# EAGLE board cfc-card (EAGLE 9.6.2), part 1 of 2
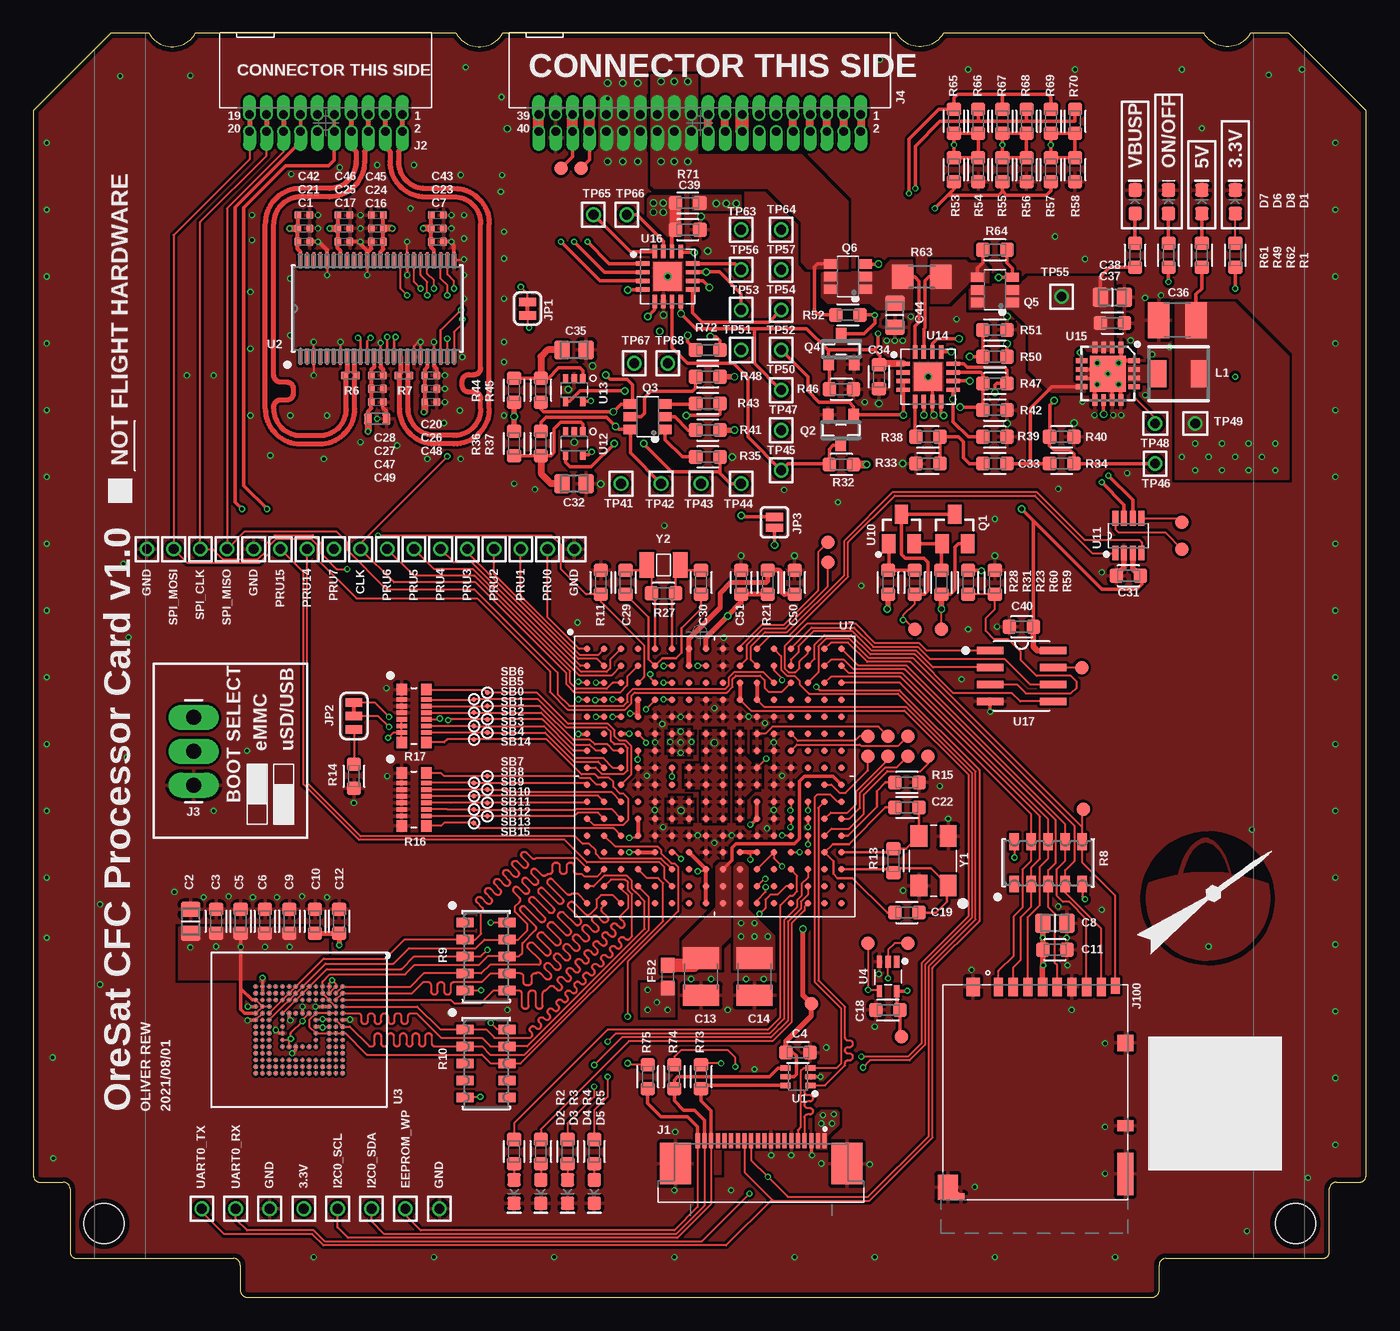
[diagram p9: board, top side]
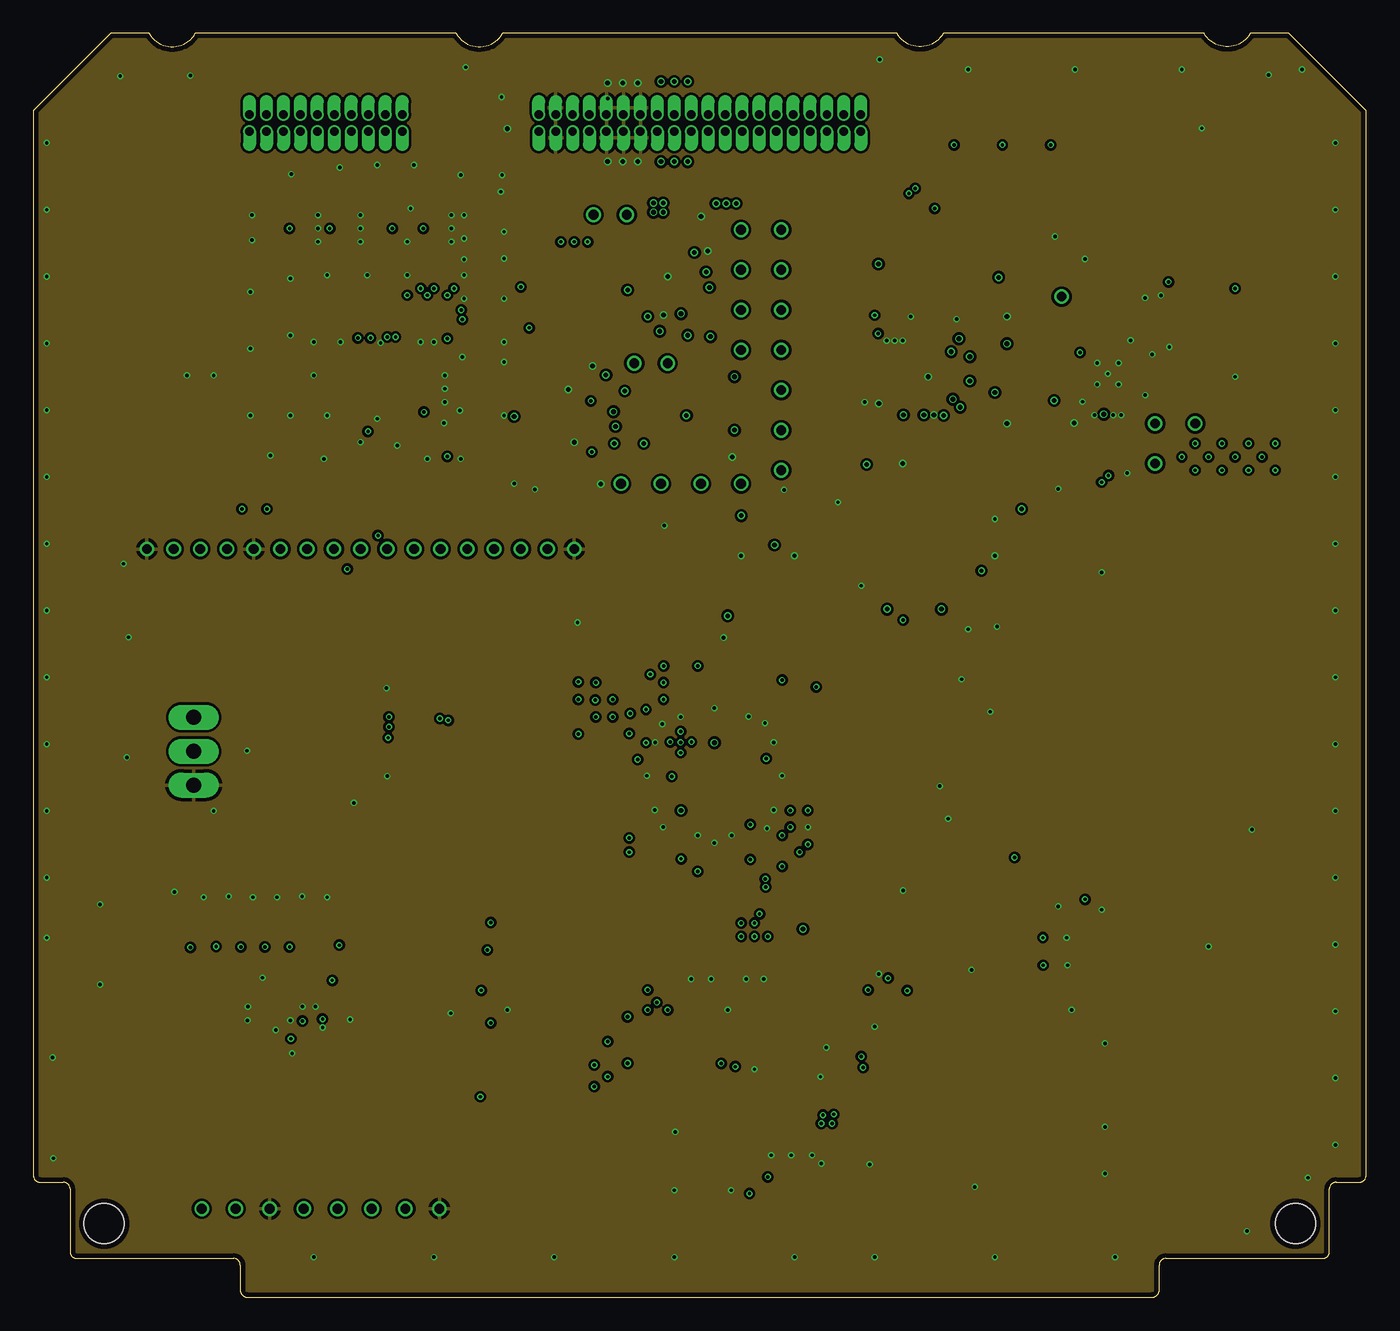
[diagram p10: board, inner layer Route2]
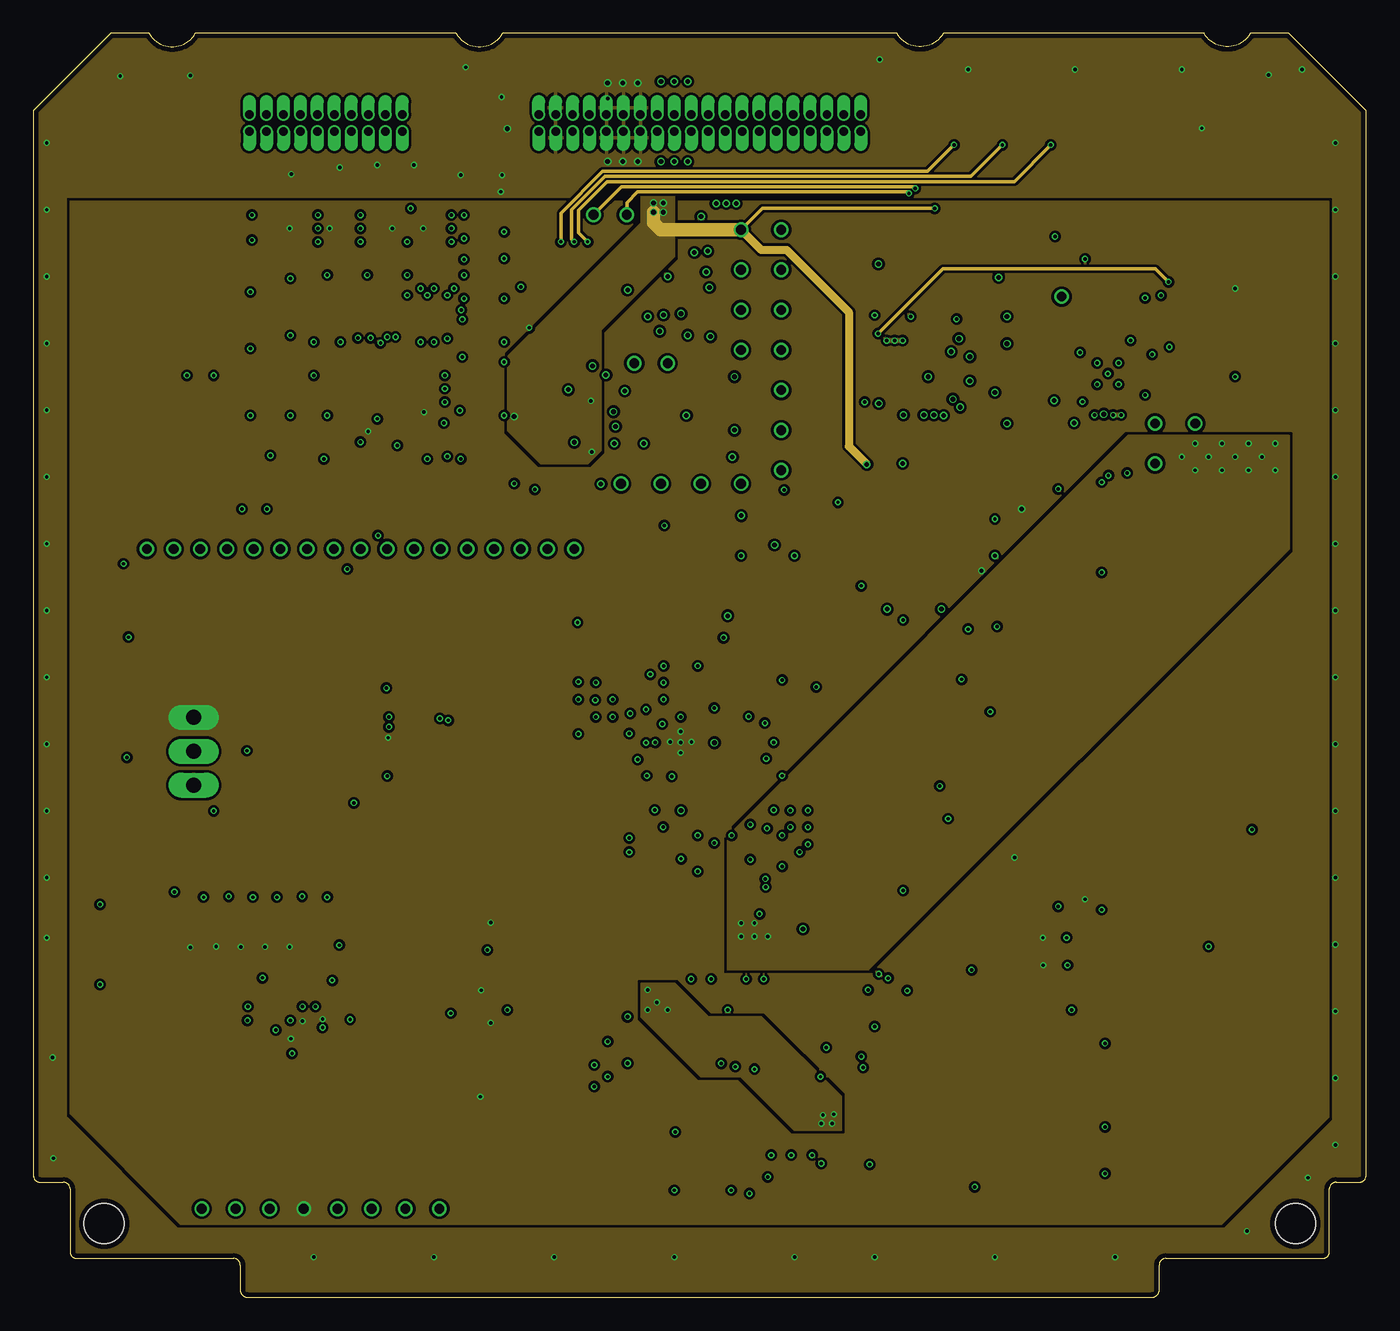
[diagram p11: board, inner layer Route15]
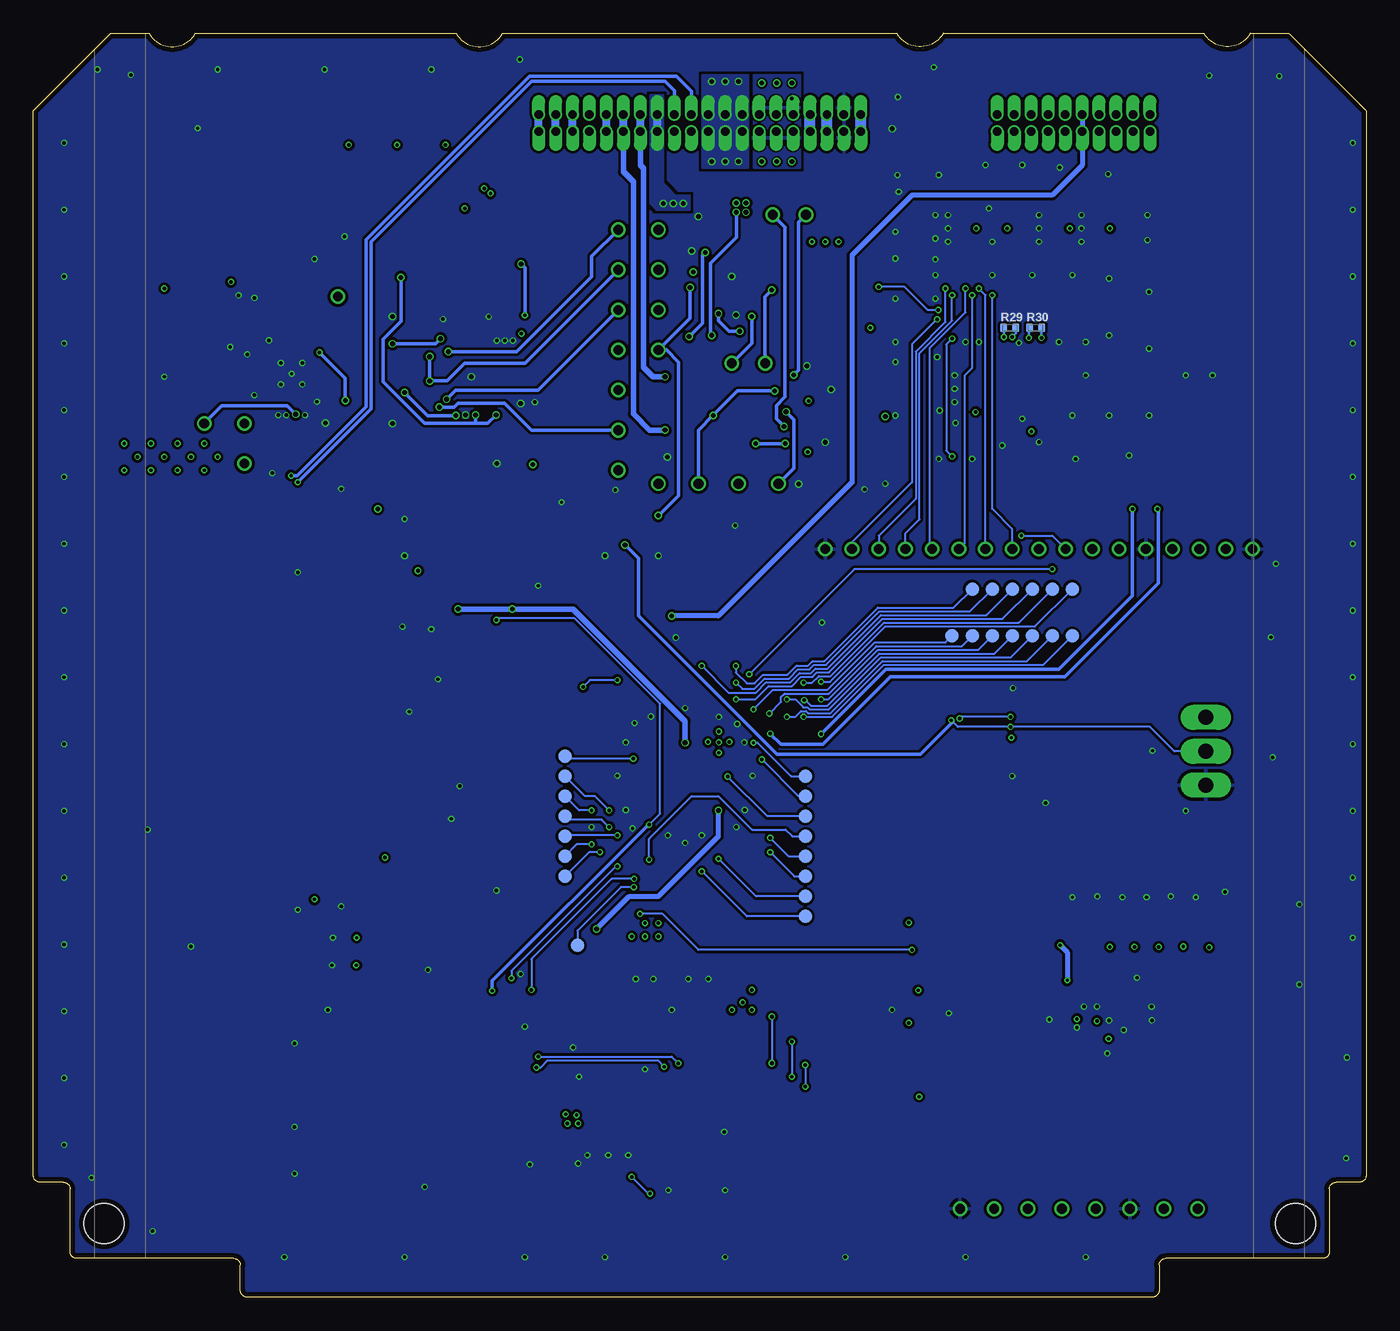
[diagram p12: board, bottom side, seen from below]

Size 99.8 x 94.6 mm. Coordinates in mm from the lower left corner, seen from the top.
Copper layers (1*2*15*16): Top 0.035559375mm / dielectric 0.17018125mm / Route2 0.01778125mm / dielectric 47mil / Route15 0.01778125mm / dielectric 0.17018125mm / Bottom 0.035559375mm
Design rules "4-layer_tented *": minimum track width 5mil, minimum drill 10mil, track to track 5mil, track to pad 5mil, pad to pad 5mil, via to via 5mil, smd to smd 5mil, copper to edge 15mil, drill to drill 6mil, minimum pad ring 4mil, minimum via ring 4mil, stop-mask expansion 2.5mil, vias tented up to drill 20mil, thermal gap 10mil
Net classes: 1 diff pair: width 0.381 mm, clearance 0.508 mm to class 0, clearance 0.254 mm

## Footprints (pad centres in the part's own frame; a part is rotated, then mirrored left to right if it is on the bottom)
.0402-C-NOSILK = smd 0.5 x 0.6: 1 -0.45,0; 2 0.45,0
.0805-B = smd 1.15 x 1.45: 1 -0.9,0; 2 0.9,0
.0603-A = smd 1 x 1.05: 1 -0.9,0; 2 0.9,0
C1210 = smd 1.6 x 2.7: 1 -1.4,0; 2 1.4,0
.0805-B-NOSILK = smd 1.15 x 1.45: 1 -0.9,0; 2 0.9,0
.0603-C-NOSILK = smd 0.6 x 0.9: 1 -0.7,0; 2 0.7,0
LED-0603 = smd 1 x 1: A -0.877,0; C 0.877,0
0603 = smd 1.1 x 1: 1 -0.85,0; 2 0.85,0
TE_2-1734592-0 = smd 0.3 x 1.1: 1 -4.75,-1.7; 2 -4.25,-1.7; 3 -3.75,-1.7; 4 -3.25,-1.7; 5 -2.75,-1.7; 6 -2.25,-1.7; 7 -1.75,-1.7; 8 -1.25,-1.7; 9 -0.75,-1.7; 10 -0.25,-1.7; 11 0.25,-1.7; 12 0.75,-1.7; 13 1.25,-1.7; 14 1.75,-1.7; 15 2.25,-1.7; 16 2.75,-1.7; 17 3.25,-1.7; 18 3.75,-1.7; 19 4.25,-1.7; 20 4.75,-1.7 | smd 2.3 x 3.1: PAD1 6.42,0; PAD2 -6.42,0
J-SAMTEC-TFM-110-X1-XXX-D-RA = drill 0.635 pad 0.965 offset: 1 5.715,0.635; 2 5.715,-0.635; 3 4.445,0.635; 4 4.445,-0.635; 5 3.175,0.635; 6 3.175,-0.635; 7 1.905,0.635; 8 1.905,-0.635; 9 0.635,0.635; 10 0.635,-0.635; 11 -0.635,0.635; 12 -0.635,-0.635; 13 -1.905,0.635; 14 -1.905,-0.635; 15 -3.175,0.635; 16 -3.175,-0.635; 17 -4.445,0.635; 18 -4.445,-0.635; 19 -5.715,0.635; 20 -5.715,-0.635
1X03_LONGPADS = drill 1.118 pad 1.88 long: 1 0,0; 2 2.54,0; 3 5.08,0
J-SAMTEC-TFM-120-X1-XXX-D-RA = drill 0.635 pad 0.965 offset: 1 12.065,0.635; 2 12.065,-0.635; 3 10.795,0.635; 4 10.795,-0.635; 5 9.525,0.635; 6 9.525,-0.635; 7 8.255,0.635; 8 8.255,-0.635; 9 6.985,0.635; 10 6.985,-0.635; 11 5.715,0.635; 12 5.715,-0.635; 13 4.445,0.635; 14 4.445,-0.635; 15 3.175,0.635; 16 3.175,-0.635; 17 1.905,0.635; 18 1.905,-0.635; 19 0.635,0.635; 20 0.635,-0.635; 21 -0.635,0.635; 22 -0.635,-0.635; 23 -1.905,0.635; 24 -1.905,-0.635; 25 -3.175,0.635; 26 -3.175,-0.635; 27 -4.445,0.635; 28 -4.445,-0.635; 29 -5.715,0.635; 30 -5.715,-0.635; 31 -6.985,0.635; 32 -6.985,-0.635; 33 -8.255,0.635; 34 -8.255,-0.635; 35 -9.525,0.635; 36 -9.525,-0.635; 37 -10.795,0.635; 38 -10.795,-0.635; 39 -12.065,0.635; 40 -12.065,-0.635
DM3BT-DSF-PEJS = smd 0.7 x 1.4: 1 -3.2,15.95; 2 -2.1,15.95; 3 -1,15.95; 4 0.1,15.95; 5 1.2,15.95; 6 2.3,15.95; 7 3.4,15.95; 8 4.5,15.95 | smd 0.7 x 1.2: CD 5.55,16.05 | smd 0.5 x 0.5: CGND1 -6,0.25 | smd 1.5 x 1.9: CGND2 -7,0.95 | smd 0.21 x 0.21 rotated 45: CGND3 -6.25,0.5 | smd 1 x 1.4: CGND4 -5.1,15.95 | smd 1.2 x 1.2: CGND5 6.3,11.75 | smd 1.2 x 3.2: CGND6 6.3,1.95 | smd 1.2 x 0.8: GND 6.3,5.55
SMT-JUMPER_2_NC_TRACE_SILK = smd 0.635 x 1.27: 1 -0.508,0; 2 0.508,0
SMT-JUMPER_3_1-NC_TRACE_SILK = smd 0.635 x 1.27: 1 -1.016,0; 2 0,0; 3 1.016,0
SMT-JUMPER_2_NO_SILK = smd 0.635 x 1.27: 1 -0.406,0; 2 0.406,0
ECS-MPI4040 = smd 2 x 1.3: 1 0,1.575; 2 0,-1.575
ORESAT-CARD-V1.3-GENERIC-0RF = hole 3: 94.5,5.5; 5.3,5.5
SOT23-BEC = smd 1 x 1.4: B -0.95,-1.1; C 0,1.1; E 0.95,-1.1
SOT23 = smd 0.787 x 0.889: 1 -0.953,-1.143; 2 0.953,-1.143; 3 0,1.143
SOT23-6 = smd 0.7 x 1: 1 -0.95,-1.3; 2 0,-1.3; 3 0.95,-1.3; 4 0.95,1.3; 5 0,1.3; 6 -0.95,1.3
ARRAY_EXBA-M = smd 1.27 x 0.711: 1 -1.575,2.54; 2 -1.575,1.27; 3 -1.575,0; 4 -1.575,-1.27; 5 -1.575,-2.54; 6 1.575,-2.54; 7 1.575,-1.27; 8 1.575,0; 9 1.575,1.27; 10 1.575,2.54
RES_EXB2HV = smd 0.787 x 0.864: 1 -0.914,1.981; 8 -0.914,-1.981; 9 0.914,-1.981; 16 0.914,1.981 | smd 0.787 x 0.356: 2 -0.914,1.234; 3 -0.914,0.74; 4 -0.914,0.247; 5 -0.914,-0.247; 6 -0.914,-0.74; 7 -0.914,-1.234; 10 0.914,-1.234; 11 0.914,-0.74; 12 0.914,-0.247; 13 0.914,0.247; 14 0.914,0.74; 15 0.914,1.234
R1206 = smd 1.6 x 1.803: 1 -1.422,0; 2 1.422,0
TEST-POINT-SMALL = smd 0.381 x 0.381: TP 0,0
2MM-TEST-POINT = drill 0.737: 1 0,0
PAD.03X.04 = smd 1.016 x 1.016: P$1 0,0
SC70-6 = smd 0.4 x 0.75: 1 -0.65,-0.925; 2 0,-0.925; 3 0.65,-0.925; 4 0.65,0.925; 5 0,0.925; 6 -0.65,0.925
MTD48_TEX-L = smd 1.168 x 0.178: 1 -3.619,5.75; 2 -3.619,5.25; 3 -3.619,4.75; 4 -3.619,4.25; 5 -3.619,3.75; 6 -3.619,3.25; 7 -3.619,2.75; 8 -3.619,2.25; 9 -3.619,1.75; 10 -3.619,1.25; 11 -3.619,0.75; 12 -3.619,0.25; 13 -3.619,-0.25; 14 -3.619,-0.75; 15 -3.619,-1.25; 16 -3.619,-1.75; 17 -3.619,-2.25; 18 -3.619,-2.75; 19 -3.619,-3.25; 20 -3.619,-3.75; 21 -3.619,-4.25; 22 -3.619,-4.75; 23 -3.619,-5.25; 24 -3.619,-5.75; 25 3.619,-5.75; 26 3.619,-5.25; 27 3.619,-4.75; 28 3.619,-4.25; 29 3.619,-3.75; 30 3.619,-3.25; 31 3.619,-2.75; 32 3.619,-2.25; 33 3.619,-1.75; 34 3.619,-1.25; 35 3.619,-0.75; 36 3.619,-0.25; 37 3.619,0.25; 38 3.619,0.75; 39 3.619,1.25; 40 3.619,1.75; 41 3.619,2.25; 42 3.619,2.75; 43 3.619,3.25; 44 3.619,3.75; 45 3.619,4.25; 46 3.619,4.75; 47 3.619,5.25; 48 3.619,5.75
BGA-153(11.5X13)(EMMC-BA) = smd 0.28 x 0.28: A1 -3.25,3.25; A2 -2.75,3.25; A3 -2.25,3.25; A4 -1.75,3.25; A5 -1.25,3.25; A6 -0.75,3.25; A7 -0.25,3.25; A8 0.25,3.25; A9 0.75,3.25; A10 1.25,3.25; A11 1.75,3.25; A12 2.25,3.25; A13 2.75,3.25; A14 3.25,3.25; B1 -3.25,2.75; B2 -2.75,2.75; B3 -2.25,2.75; B4 -1.75,2.75; B5 -1.25,2.75; B6 -0.75,2.75; B7 -0.25,2.75; B8 0.25,2.75; B9 0.75,2.75; B10 1.25,2.75; B11 1.75,2.75; B12 2.25,2.75; B13 2.75,2.75; B14 3.25,2.75; C1 -3.25,2.25; C2 -2.75,2.25; C3 -2.25,2.25; C4 -1.75,2.25; C5 -1.25,2.25; C6 -0.75,2.25; C7 -0.25,2.25; C8 0.25,2.25; C9 0.75,2.25; C10 1.25,2.25; C11 1.75,2.25; C12 2.25,2.25; C13 2.75,2.25; C14 3.25,2.25; D1 -3.25,1.75; D2 -2.75,1.75; D3 -2.25,1.75; D4 -1.75,1.75; D12 2.25,1.75; D13 2.75,1.75; D14 3.25,1.75; E1 -3.25,1.25; E2 -2.75,1.25; E3 -2.25,1.25; E5 -1.25,1.25; E6 -0.75,1.25; E7 -0.25,1.25; E8 0.25,1.25; E9 0.75,1.25; E10 1.25,1.25; E12 2.25,1.25; E13 2.75,1.25; E14 3.25,1.25; F1 -3.25,0.75; F2 -2.75,0.75; F3 -2.25,0.75; F5 -1.25,0.75; F10 1.25,0.75; F12 2.25,0.75; F13 2.75,0.75; F14 3.25,0.75; G1 -3.25,0.25; G2 -2.75,0.25; G3 -2.25,0.25; G5 -1.25,0.25; G10 1.25,0.25; G12 2.25,0.25; G13 2.75,0.25; G14 3.25,0.25; H1 -3.25,-0.25; H2 -2.75,-0.25; H3 -2.25,-0.25; H5 -1.25,-0.25; H10 1.25,-0.25; H12 2.25,-0.25; H13 2.75,-0.25; H14 3.25,-0.25; J1 -3.25,-0.75; J2 -2.75,-0.75; J3 -2.25,-0.75; J5 -1.25,-0.75; J10 1.25,-0.75; J12 2.25,-0.75; J13 2.75,-0.75; J14 3.25,-0.75; K1 -3.25,-1.25; K2 -2.75,-1.25; K3 -2.25,-1.25; K5 -1.25,-1.25; K6 -0.75,-1.25; K7 -0.25,-1.25; K8 0.25,-1.25; K9 0.75,-1.25; K10 1.25,-1.25; K12 2.25,-1.25; K13 2.75,-1.25; K14 3.25,-1.25; L1 -3.25,-1.75; L2 -2.75,-1.75; L3 -2.25,-1.75; L12 2.25,-1.75; L13 2.75,-1.75; L14 3.25,-1.75; M1 -3.25,-2.25; M2 -2.75,-2.25; M3 -2.25,-2.25; M4 -1.75,-2.25; M5 -1.25,-2.25; M6 -0.75,-2.25; M7 -0.25,-2.25; M8 0.25,-2.25; M9 0.75,-2.25; M10 1.25,-2.25; M11 1.75,-2.25; M12 2.25,-2.25; M13 2.75,-2.25; M14 3.25,-2.25; N1 -3.25,-2.75; N2 -2.75,-2.75; N3 -2.25,-2.75; N4 -1.75,-2.75; N5 -1.25,-2.75; N6 -0.75,-2.75; N7 -0.25,-2.75; N8 0.25,-2.75; N9 0.75,-2.75; N10 1.25,-2.75; N11 1.75,-2.75; N12 2.25,-2.75; N13 2.75,-2.75; N14 3.25,-2.75; P1 -3.25,-3.25; P2 -2.75,-3.25; P3 -2.25,-3.25; P4 -1.75,-3.25; P5 -1.25,-3.25; P6 -0.75,-3.25; P7 -0.25,-3.25; P8 0.25,-3.25; P9 0.75,-3.25; P10 1.25,-3.25; P11 1.75,-3.25; P12 2.25,-3.25; P13 2.75,-3.25; P14 3.25,-3.25
C70(TI-DCK) = smd 0.4 x 0.9: 1 0.65,1.1; 2 0,1.1; 3 -0.65,1.1; 4 -0.65,-1.1; 5 0.65,-1.1
OSD335X-BGA-256 = smd 0.5 x 0.5: A1 -9.525,-9.525; A2 -9.525,-8.255; A3 -9.525,-6.985; A4 -9.525,-5.715; A5 -9.525,-4.445; A6 -9.525,-3.175; A7 -9.525,-1.905; A8 -9.525,-0.635; A9 -9.525,0.635; A10 -9.525,1.905; A11 -9.525,3.175; A12 -9.525,4.445; A13 -9.525,5.715; A14 -9.525,6.985; A15 -9.525,8.255; A16 -9.525,9.525; B1 -8.255,-9.525; B2 -8.255,-8.255; B3 -8.255,-6.985; B4 -8.255,-5.715; B5 -8.255,-4.445; B6 -8.255,-3.175; B7 -8.255,-1.905; B8 -8.255,-0.635; B9 -8.255,0.635; B10 -8.255,1.905; B11 -8.255,3.175; B12 -8.255,4.445; B13 -8.255,5.715; B14 -8.255,6.985; B15 -8.255,8.255; B16 -8.255,9.525; C1 -6.985,-9.525; C2 -6.985,-8.255; C3 -6.985,-6.985; C4 -6.985,-5.715; C5 -6.985,-4.445; C6 -6.985,-3.175; C7 -6.985,-1.905; C8 -6.985,-0.635; C9 -6.985,0.635; C10 -6.985,1.905; C11 -6.985,3.175; C12 -6.985,4.445; C13 -6.985,5.715; C14 -6.985,6.985; C15 -6.985,8.255; C16 -6.985,9.525; D1 -5.715,-9.525; D2 -5.715,-8.255; D3 -5.715,-6.985; D4 -5.715,-5.715; D5 -5.715,-4.445; D6 -5.715,-3.175; D7 -5.715,-1.905; D8 -5.715,-0.635; D9 -5.715,0.635; D10 -5.715,1.905; D11 -5.715,3.175; D12 -5.715,4.445; D13 -5.715,5.715; D14 -5.715,6.985; D15 -5.715,8.255; D16 -5.715,9.525; E1 -4.445,-9.525; E2 -4.445,-8.255; E3 -4.445,-6.985; E4 -4.445,-5.715; E5 -4.445,-4.445; E6 -4.445,-3.175; E7 -4.445,-1.905; E8 -4.445,-0.635; E9 -4.445,0.635; E10 -4.445,1.905; E11 -4.445,3.175; E12 -4.445,4.445; E13 -4.445,5.715; E14 -4.445,6.985; E15 -4.445,8.255; E16 -4.445,9.525; F1 -3.175,-9.525; F2 -3.175,-8.255; F3 -3.175,-6.985; F4 -3.175,-5.715; F5 -3.175,-4.445; F6 -3.175,-3.175; F7 -3.175,-1.905; F8 -3.175,-0.635; F9 -3.175,0.635; F10 -3.175,1.905; F11 -3.175,3.175; F12 -3.175,4.445; F13 -3.175,5.715; F14 -3.175,6.985; F15 -3.175,8.255; F16 -3.175,9.525; G1 -1.905,-9.525; G2 -1.905,-8.255; G3 -1.905,-6.985; G4 -1.905,-5.715; G5 -1.905,-4.445; G6 -1.905,-3.175; G7 -1.905,-1.905; G8 -1.905,-0.635; G9 -1.905,0.635; G10 -1.905,1.905; G11 -1.905,3.175; G12 -1.905,4.445; G13 -1.905,5.715; G14 -1.905,6.985; G15 -1.905,8.255; G16 -1.905,9.525; H1 -0.635,-9.525; H2 -0.635,-8.255; H3 -0.635,-6.985; H4 -0.635,-5.715; H5 -0.635,-4.445; H6 -0.635,-3.175; H7 -0.635,-1.905; H8 -0.635,-0.635; H9 -0.635,0.635; H10 -0.635,1.905; H11 -0.635,3.175; H12 -0.635,4.445; H13 -0.635,5.715; H14 -0.635,6.985; H15 -0.635,8.255; H16 -0.635,9.525; J1 0.635,-9.525; J2 0.635,-8.255; J3 0.635,-6.985; J4 0.635,-5.715; J5 0.635,-4.445; J6 0.635,-3.175; J7 0.635,-1.905; J8 0.635,-0.635; J9 0.635,0.635; J10 0.635,1.905; J11 0.635,3.175; J12 0.635,4.445; J13 0.635,5.715; J14 0.635,6.985; J15 0.635,8.255; J16 0.635,9.525; K1 1.905,-9.525; K2 1.905,-8.255; K3 1.905,-6.985; K4 1.905,-5.715; K5 1.905,-4.445; K6 1.905,-3.175; K7 1.905,-1.905; K8 1.905,-0.635; K9 1.905,0.635; K10 1.905,1.905; K11 1.905,3.175; K12 1.905,4.445; K13 1.905,5.715; K14 1.905,6.985; K15 1.905,8.255; K16 1.905,9.525; L1 3.175,-9.525; L2 3.175,-8.255; L3 3.175,-6.985; L4 3.175,-5.715; L5 3.175,-4.445; L6 3.175,-3.175; L7 3.175,-1.905; L8 3.175,-0.635; L9 3.175,0.635; L10 3.175,1.905; L11 3.175,3.175; L12 3.175,4.445; L13 3.175,5.715; L14 3.175,6.985; L15 3.175,8.255; L16 3.175,9.525; M1 4.445,-9.525; M2 4.445,-8.255; M3 4.445,-6.985; M4 4.445,-5.715; M5 4.445,-4.445; M6 4.445,-3.175; M7 4.445,-1.905; M8 4.445,-0.635; M9 4.445,0.635; M10 4.445,1.905; M11 4.445,3.175; M12 4.445,4.445; M13 4.445,5.715; M14 4.445,6.985; M15 4.445,8.255; M16 4.445,9.525; N1 5.715,-9.525; N2 5.715,-8.255; N3 5.715,-6.985; N4 5.715,-5.715; N5 5.715,-4.445; N6 5.715,-3.175; N7 5.715,-1.905; N8 5.715,-0.635; N9 5.715,0.635; N10 5.715,1.905; N11 5.715,3.175; N12 5.715,4.445; N13 5.715,5.715; N14 5.715,6.985; N15 5.715,8.255; N16 5.715,9.525; P1 6.985,-9.525; P2 6.985,-8.255; P3 6.985,-6.985; P4 6.985,-5.715; P5 6.985,-4.445; P6 6.985,-3.175; P7 6.985,-1.905; P8 6.985,-0.635; P9 6.985,0.635; P10 6.985,1.905; P11 6.985,3.175; P12 6.985,4.445; P13 6.985,5.715; P14 6.985,6.985; P15 6.985,8.255; P16 6.985,9.525; R1 8.255,-9.525; R2 8.255,-8.255; R3 8.255,-6.985; R4 8.255,-5.715; R5 8.255,-4.445; R6 8.255,-3.175; R7 8.255,-1.905; R8 8.255,-0.635; R9 8.255,0.635; R10 8.255,1.905; R11 8.255,3.175; R12 8.255,4.445; R13 8.255,5.715; R14 8.255,6.985; R15 8.255,8.255; R16 8.255,9.525; T1 9.525,-9.525; T2 9.525,-8.255; T3 9.525,-6.985; T4 9.525,-5.715; T5 9.525,-4.445; T6 9.525,-3.175; T7 9.525,-1.905; T8 9.525,-0.635; T9 9.525,0.635; T10 9.525,1.905; T11 9.525,3.175; T12 9.525,4.445; T13 9.525,5.715; T14 9.525,6.985; T15 9.525,8.255; T16 9.525,9.525
SOT23-3 = smd 1 x 1.4: 1 -0.95,-1.1; 2 0.95,-1.1; 3 0,1.1
SOT23-8_TI-DCN = smd 0.45 x 1.1: 1 -0.975,-1.3; 2 -0.325,-1.3; 3 0.325,-1.3; 4 0.975,-1.3; 5 0.975,1.3; 6 0.325,1.3; 7 -0.325,1.3; 8 -0.975,1.3
SC70-5 = smd 0.4 x 0.7: 1 -0.65,-0.85; 2 0,-0.85; 3 0.65,-0.85; 4 0.65,0.85; 5 -0.65,0.85
QFN65P400X400X80-17T210 = smd 1.01 x 0.32: 1 -1.86,0.975; 2 -1.86,0.325; 3 -1.86,-0.325; 4 -1.86,-0.975; 9 1.86,-0.975; 10 1.86,-0.325; 11 1.86,0.325; 12 1.86,0.975 | smd 0.32 x 1.01: 5 -0.975,-1.86; 6 -0.325,-1.86; 7 0.325,-1.86; 8 0.975,-1.86; 13 0.975,1.86; 14 0.325,1.86; 15 -0.325,1.86; 16 -0.975,1.86 | smd 2.1 x 2.1: EPAD 0,0
S-PVQFN-16 = smd 0.85 x 0.35: 1 -1.975,0.975; 2 -1.975,0.325; 3 -1.975,-0.325; 4 -1.975,-0.975; 9 1.975,-0.975; 10 1.975,-0.325; 11 1.975,0.325; 12 1.975,0.975 | smd 0.35 x 0.85: 5 -0.975,-1.975; 6 -0.325,-1.975; 7 0.325,-1.975; 8 0.975,-1.975; 13 0.975,1.975; 14 0.325,1.975; 15 -0.325,1.975; 16 -0.975,1.975 | smd 2.7 x 2.7: PAD 0,0
SOIC8 = smd 1.981 x 0.559: 1 -2.362,1.905; 2 -2.362,0.635; 3 -2.362,-0.635; 4 -2.362,-1.905; 5 2.362,-1.905; 6 2.362,-0.635; 7 2.362,0.635; 8 2.362,1.905
5X3.2-4SMD = smd 1.6 x 1.25: 1 -1.85,-1.1; 2 1.85,-1.1; 3 1.85,1.1; 4 -1.85,1.1
CRYSTAL_3.2X1.5 = smd 1.1 x 1.9: P$1 -1.25,0; P$2 1.25,0

## Placement (x,y rotation side)
C1  1n  [.0402-C-NOSILK]  20.25,79 0 top
C2  10uF  [.0805-B]  11.78,28.12 90 top
C3  1uF  [.0603-A]  13.68,28.12 90 top
C4  0.1uF  [.0603-A]  57.25,18.31 0 top
C5  1uF  [.0603-A]  15.53,28.12 90 top
C6  1uF  [.0603-A]  17.34,28.12 90 top
C7  1n  [.0402-C-NOSILK]  30.25,79 0 top
C8  10uF  [.0805-B]  76.5,28 0 top
C9  1uF  [.0603-A]  19.18,28.12 90 top
C10  1uF  [.0603-A]  21.09,28.12 90 top
C11  0.1uF  [.0603-A]  76.5,26 0 top
C12  1uF  [.0603-A]  22.9,28.12 90 top
C13  22uF  [C1210]  50,24 270 top
C14  22uF  [C1210]  54,24 270 top
C16  1n  [.0402-C-NOSILK]  25.75,79 180 top
C17  1n  [.0402-C-NOSILK]  23.25,79 0 top
C18  0.1uF  [.0603-A]  64,21.5 180 top
C19  18pF, 50V  [.0603-A]  65.41,28.78 0 top
C20  1n  [.0402-C-NOSILK]  29.75,69 0 top
C21  10n  [.0402-C-NOSILK]  20.25,80 0 top
C22  18pF, 50V  [.0603-A]  65.41,36.66 0 top
C23  10n  [.0402-C-NOSILK]  30.25,80 0 top
C24  10n  [.0402-C-NOSILK]  25.75,80 180 top
C25  10n  [.0402-C-NOSILK]  23.25,80 0 top
C26  10n  [.0402-C-NOSILK]  29.75,68 0 top
C27  10n  [.0402-C-NOSILK]  25.75,68 0 top
C28  1n  [.0402-C-NOSILK]  25.75,69 0 top
C29  18pF, 50V  [.0603-A]  44.34,53.5 270 top
C30  18pF, 50V  [.0603-A]  50,53.5 270 top
C31  0.1uF  [.0603-A]  82,54 0 top
C32  1uF  [.0805-B-NOSILK]  40.5,60.9 0 top
C33  1uF  [.0603-A]  72,62.4 0 top
C34  1uF  [.0603-A]  63.31,68.9 270 top
C35  1uF  [.0805-B-NOSILK]  40.5,70.9 0 top
C36  22uF  [C1210]  85.66,73.14 180 top
C37  1uF  [.0603-A]  80.8,72.91 0 top
C38  10uF  [.0805-B]  80.79,74.84 0 top
C39  0.1uF  [.0603-A]  49,79.9 180 top
C40  DNP  [.0603-A]  74,50.19 0 top
C42  100n  [.0402-C-NOSILK]  20.25,81 0 top
C43  100n  [.0402-C-NOSILK]  30.25,81 0 top
C44  10uF  [.0805-B]  64.5,73.5 270 top
C45  100n  [.0402-C-NOSILK]  25.75,81 180 top
C46  100n  [.0402-C-NOSILK]  23.25,81 0 top
C47  100n  [.0402-C-NOSILK]  25.75,67 0 top
C48  100n  [.0402-C-NOSILK]  29.75,67 0 top
C49  10u  [.0603-C-NOSILK]  25.75,65.75 0 top
C50  0.1uF  [.0603-A]  57,53.5 90 top
C51  0.1u  [.0603-A]  53,53.5 90 top
D1  GREEN  [LED-0603]  90,82 90 top
D2  BLUE  [LED-0603]  36,7.9 270 top
D3  BLUE  [LED-0603]  38,7.9 270 top
D4  BLUE  [LED-0603]  40,7.9 270 top
D5  BLUE  [LED-0603]  42,7.9 270 top
D6  AMBER  [LED-0603]  85,82 90 top
D7  GREEN  [LED-0603]  82.5,82 90 top
D8  GREEN  [LED-0603]  87.5,82 90 top
FB2  30Ω/1.8A  [0603]  47.5,24 90 top
J1  ORESAT-DEBUG-CONNECTOR-ALL  [TE_2-1734592-0]  54.5,10 180 top
J2  J-SAMTEC-TFM-110-X1-XXX-D-RA  [J-SAMTEC-TFM-110-X1-XXX-D-RA]  21.9,87.9 0 top
J3  [1X03_LONGPADS]  12,43.4 270 top
J4  TFM-120-01-L-D-RA  [J-SAMTEC-TFM-120-X1-XXX-D-RA]  49.9,87.9 0 top
J100  DM3BT-DSF-PEJS  [DM3BT-DSF-PEJS]  75.47,7.28 0 top
JP1  JUMPER-SMT_2_NC_TRACE_SILK  [SMT-JUMPER_2_NC_TRACE_SILK]  37,74 90 top
JP2  JUMPER-SMT_3_1-NC_TRACE_SILK  [SMT-JUMPER_3_1-NC_TRACE_SILK]  24,43.5 90 top
JP3  JUMPER-SMT_2_NO_SILK  [SMT-JUMPER_2_NO_SILK]  55.5,58 270 top
L1  6.8u  [ECS-MPI4040]  85.76,69.12 90 top
PCB1  ORESAT-CARD-V1.3-GENERIC-0RF  [ORESAT-CARD-V1.3-GENERIC-0RF]  0,0 0 top
Q1  MMBT2907  [SOT23-BEC]  69,57.5 0 top
Q2  PMV45EN  [SOT23]  60.47,64.9 180 top
Q3  DMP2240UDM  [SOT23-6]  46,65.9 90 top
Q4  PMV45EN  [SOT23]  60.5,70.96 0 top
Q5  MOSFET-PCH-SOT23-6  [SOT23-6]  72,75.4 90 top
Q6  MOSFET-PCH-SOT23-6  [SOT23-6]  61,76.4 90 top
R1  1k  [.0603-A]  90,78 90 top
R2  1k  [.0603-A]  36,10.9 270 top
R3  1k  [.0603-A]  38,10.9 270 top
R4  1k  [.0603-A]  40,10.9 270 top
R5  1k  [.0603-A]  42,10.9 270 top
R6  100  [.0402-C-NOSILK]  23.75,69 180 top
R7  100  [.0402-C-NOSILK]  27.75,69 0 top
R8  10K  [ARRAY_EXBA-M]  76,32.5 90 top
R9  10K  [ARRAY_EXBA-M]  33.9,25.5 0 top
R10  10K  [ARRAY_EXBA-M]  33.9,17.5 0 top
R11  DNP  [.0603-A]  42.5,53.5 270 top
R13  1M  [.0603-A]  64.41,32.66 270 top
R14  DNP  [.0603-A]  24,39 90 top
R15  10k  [.0603-A]  65.41,38.53 180 top
R16  100k  [RES_EXB2HV]  28.5,37.25 0 top
R17  100k  [RES_EXB2HV]  28.5,43.5 0 top
R21  10k  [.0603-A]  55,53.5 90 top
R23  499  [.0603-A]  68,53.5 270 top
R27  DNP  [.0603-A]  47.19,52.69 0 top
R28  10k  [.0603-A]  64,53.5 270 top
R29  NP  [.0402-C-NOSILK]  26.69,72.56 0 bottom
R30  NP  [.0402-C-NOSILK]  24.75,72.56 0 bottom
R31  40.2K  [.0603-A]  66,53.5 90 top
R32  10k  [.0603-A]  60.5,62.34 0 top
R33  100k  [.0603-A]  67,62.4 0 top
R34  10k  [.0603-A]  77,62.4 180 top
R35  665k  [.0603-A]  50.5,62.9 180 top
R36  1M  [.0603-A]  36,63.9 90 top
R37  330k  [.0603-A]  38,63.9 90 top
R38  10k  [.0603-A]  67,64.4 0 top
R39  10k  [.0603-A]  72,64.4 180 top
R40  NP  [.0603-A]  77,64.4 180 top
R41  100  [.0603-A]  50.5,64.9 180 top
R42  NP  [.0603-A]  72,66.4 180 top
R43  665k  [.0603-A]  50.5,66.9 180 top
R44  1M  [.0603-A]  36,67.9 270 top
R45  330k  [.0603-A]  38,67.9 270 top
R46  10k  [.0603-A]  60.5,67.96 180 top
R47  0  [.0603-A]  72,68.4 0 top
R48  100  [.0603-A]  50.5,68.9 180 top
R49  2.7k  [.0603-A]  85,78 270 top
R50  10k  [.0603-A]  72,70.4 0 top
R51  4.7k  [.0603-A]  72,72.4 180 top
R52  10k  [.0603-A]  61,73.53 180 top
R53  NP  [.0603-A]  68.94,84.4 270 top
R54  NP  [.0603-A]  70.75,84.4 90 top
R55  NP  [.0603-A]  72.56,84.4 270 top
R56  NP  [.0603-A]  74.38,84.4 90 top
R57  NP  [.0603-A]  76.19,84.4 270 top
R58  NP  [.0603-A]  78,84.4 90 top
R59  DNP  [.0603-A]  72,53.5 90 top
R60  DNP  [.0603-A]  70,53.5 270 top
R61  2.7k  [.0603-A]  82.5,78 270 top
R62  2.7k  [.0603-A]  87.5,78 270 top
R63  100m  [R1206]  66.53,76.37 0 top
R64  10k  [.0603-A]  72,78.4 180 top
R65  NP  [.0603-A]  68.94,88.03 270 top
R66  NP  [.0603-A]  70.75,88.03 90 top
R67  NP  [.0603-A]  72.56,88.03 270 top
R68  NP  [.0603-A]  74.38,88.03 90 top
R69  NP  [.0603-A]  76.19,88.03 270 top
R70  NP  [.0603-A]  78,88.03 90 top
R71  100  [.0603-A]  49,81.9 180 top
R72  10k  [.0603-A]  50.5,70.9 180 top
R73  100  [.0603-A]  50,16.5 90 top
R74  100  [.0603-A]  48,16.5 90 top
R75  100  [.0603-A]  46,16.5 90 top
SB0  TEST-POINT-SMALL  [TEST-POINT-SMALL]  34,44.25 0 top
SB1  TEST-POINT-SMALL  [TEST-POINT-SMALL]  33,43.75 0 top
SB2  TEST-POINT-SMALL  [TEST-POINT-SMALL]  34,43.25 0 top
SB3  TEST-POINT-SMALL  [TEST-POINT-SMALL]  33,42.75 0 top
SB4  TEST-POINT-SMALL  [TEST-POINT-SMALL]  34,42.25 0 top
SB5  TEST-POINT-SMALL  [TEST-POINT-SMALL]  33,44.75 0 top
SB6  TEST-POINT-SMALL  [TEST-POINT-SMALL]  34,45.25 0 top
SB7  TEST-POINT-SMALL  [TEST-POINT-SMALL]  34,39 0 top
SB8  TEST-POINT-SMALL  [TEST-POINT-SMALL]  33,38.5 0 top
SB9  TEST-POINT-SMALL  [TEST-POINT-SMALL]  34,38 0 top
SB10  TEST-POINT-SMALL  [TEST-POINT-SMALL]  33,37.5 0 top
SB11  TEST-POINT-SMALL  [TEST-POINT-SMALL]  34,37 0 top
SB12  TEST-POINT-SMALL  [TEST-POINT-SMALL]  33,36.5 0 top
SB13  TEST-POINT-SMALL  [TEST-POINT-SMALL]  34,36 0 top
SB14  TEST-POINT-SMALL  [TEST-POINT-SMALL]  33,41.75 0 top
SB15  TEST-POINT-SMALL  [TEST-POINT-SMALL]  33,35.5 0 top
TP1  TEST-POINT  [2MM-TEST-POINT]  14.5,56 0 top
TP2  TEST-POINT  [2MM-TEST-POINT]  20.25,6.62 0 top
TP3  TEST-POINT3X4  [PAD.03X.04]  58.25,21.96 90 top
TP4  TEST-POINT3X4  [PAD.03X.04]  59.5,55 180 top
TP5  TEST-POINT3X4  [PAD.03X.04]  22,53 0 bottom
TP6  TEST-POINT3X4  [PAD.03X.04]  23.5,53 0 bottom
TP7  TEST-POINT3X4  [PAD.03X.04]  28,49.5 0 bottom
TP8  TEST-POINT3X4  [PAD.03X.04]  26.5,49.5 0 bottom
TP9  TEST-POINT3X4  [PAD.03X.04]  25,49.5 0 bottom
TP10  TEST-POINT3X4  [PAD.03X.04]  22,49.5 0 bottom
TP11  TEST-POINT3X4  [PAD.03X.04]  23.5,49.5 0 bottom
TP12  TEST-POINT3X4  [PAD.03X.04]  60,33 0 bottom
TP13  TEST-POINT3X4  [PAD.03X.04]  59.5,56.5 180 top
TP14  TEST-POINT3X4  [PAD.03X.04]  65,19.5 180 top
TP15  TEST-POINT3X4  [PAD.03X.04]  64,40.5 0 top
TP16  TEST-POINT3X4  [PAD.03X.04]  65.5,40.5 0 top
TP17  TEST-POINT3X4  [PAD.03X.04]  67,40.5 0 top
TP18  TEST-POINT  [2MM-TEST-POINT]  10.5,56 0 top
TP19  TEST-POINT  [2MM-TEST-POINT]  12.5,56 0 top
TP20  TEST-POINT  [2MM-TEST-POINT]  24.5,56 0 top
TP21  TEST-POINT  [2MM-TEST-POINT]  22.5,56 0 top
TP22  TEST-POINT3X4  [PAD.03X.04]  78.62,36.53 0 top
TP23  TEST-POINT  [2MM-TEST-POINT]  26.5,56 0 top
TP24  TEST-POINT  [2MM-TEST-POINT]  28.5,56 0 top
TP26  TEST-POINT  [2MM-TEST-POINT]  30.5,56 0 top
TP27  TEST-POINT  [2MM-TEST-POINT]  32.5,56 0 top
TP28  TEST-POINT  [2MM-TEST-POINT]  34.5,56 0 top
TP29  TEST-POINT  [2MM-TEST-POINT]  36.5,56 0 top
TP30  TEST-POINT  [2MM-TEST-POINT]  38.5,56 0 top
TP31  TEST-POINT  [2MM-TEST-POINT]  15.15,6.61 0 top
TP32  TEST-POINT  [2MM-TEST-POINT]  12.62,6.61 0 top
TP33  TEST-POINT  [2MM-TEST-POINT]  20.5,56 0 top
TP34  TEST-POINT  [2MM-TEST-POINT]  18.5,56 0 top
TP35  TEST-POINT3X4  [PAD.03X.04]  86,58 180 top
TP36  TEST-POINT3X4  [PAD.03X.04]  26.5,53 180 bottom
TP37  TEST-POINT3X4  [PAD.03X.04]  29.5,53 180 bottom
TP38  TEST-POINT3X4  [PAD.03X.04]  28,53 180 bottom
TP39  TEST-POINT  [2MM-TEST-POINT]  22.78,6.62 0 top
TP40  TEST-POINT3X4  [PAD.03X.04]  86,56 180 top
TP41  TEST-POINT  [2MM-TEST-POINT]  44,60.9 0 top
TP42  TEST-POINT  [2MM-TEST-POINT]  47,60.9 0 top
TP43  TEST-POINT  [2MM-TEST-POINT]  50,60.9 0 top
TP44  TEST-POINT  [2MM-TEST-POINT]  53,60.9 0 top
TP45  TEST-POINT  [2MM-TEST-POINT]  56,61.9 0 top
TP46  TEST-POINT  [2MM-TEST-POINT]  84,62.4 0 top
TP47  TEST-POINT  [2MM-TEST-POINT]  56,64.9 0 top
TP48  TEST-POINT  [2MM-TEST-POINT]  84,65.4 270 top
TP49  TEST-POINT  [2MM-TEST-POINT]  87,65.4 270 top
TP50  TEST-POINT  [2MM-TEST-POINT]  56,67.9 0 top
TP51  TEST-POINT  [2MM-TEST-POINT]  53,70.9 0 top
TP52  TEST-POINT  [2MM-TEST-POINT]  56,70.9 0 top
TP53  TEST-POINT  [2MM-TEST-POINT]  53,73.9 0 top
TP54  TEST-POINT  [2MM-TEST-POINT]  56,73.9 0 top
TP55  TEST-POINT  [2MM-TEST-POINT]  77,74.9 0 top
TP56  TEST-POINT  [2MM-TEST-POINT]  53,76.9 0 top
TP57  TEST-POINT  [2MM-TEST-POINT]  56,76.9 0 top
TP63  TEST-POINT  [2MM-TEST-POINT]  53,79.9 0 top
TP64  TEST-POINT  [2MM-TEST-POINT]  56,79.9 0 top
TP65  TEST-POINT  [2MM-TEST-POINT]  41.94,81.03 0 top
TP66  TEST-POINT  [2MM-TEST-POINT]  44.44,81.03 0 top
TP67  TEST-POINT  [2MM-TEST-POINT]  45,69.9 0 top
TP68  TEST-POINT  [2MM-TEST-POINT]  47.5,69.9 0 top
TP69  TEST-POINT3X4  [PAD.03X.04]  78.5,47.12 180 top
TP70  TEST-POINT  [2MM-TEST-POINT]  25.32,6.62 0 top
TP71  TEST-POINT  [2MM-TEST-POINT]  27.86,6.62 0 top
TP72  TEST-POINT  [2MM-TEST-POINT]  30.4,6.62 0 top
TP74  TEST-POINT  [2MM-TEST-POINT]  8.5,56 180 top
TP75  TEST-POINT  [2MM-TEST-POINT]  16.5,56 0 top
TP77  TEST-POINT  [2MM-TEST-POINT]  40.5,56 0 top
TP78  TEST-POINT  [2MM-TEST-POINT]  17.7,6.61 0 top
TP102  TEST-POINT3X4  [PAD.03X.04]  59.06,26.32 180 bottom
TP109  TEST-POINT3X4  [PAD.03X.04]  62.5,26.5 0 top
TP110  TEST-POINT3X4  [PAD.03X.04]  65.5,26.5 0 top
TP121  TEST-POINT3X4  [PAD.03X.04]  41.97,34.49 90 bottom
TP129  TEST-POINT3X4  [PAD.03X.04]  42,30 90 bottom
TP130  TEST-POINT3X4  [PAD.03X.04]  42,28.5 90 bottom
TP132  TEST-POINT3X4  [PAD.03X.04]  42,31.5 90 bottom
TP133  TEST-POINT3X4  [PAD.03X.04]  60,31.5 0 bottom
TP136  TEST-POINT3X4  [PAD.03X.04]  60,34.5 0 bottom
TP138  TEST-POINT3X4  [PAD.03X.04]  60,37.5 0 bottom
TP139  TEST-POINT3X4  [PAD.03X.04]  62.5,40.5 0 top
TP140  TEST-POINT3X4  [PAD.03X.04]  42,33 90 bottom
TP141  TEST-POINT3X4  [PAD.03X.04]  60,39 0 bottom
TP144  TEST-POINT3X4  [PAD.03X.04]  60,36 0 bottom
TP154  TEST-POINT3X4  [PAD.03X.04]  42,37.5 0 bottom
TP156  TEST-POINT3X4  [PAD.03X.04]  42,39 0 bottom
TP157  TEST-POINT3X4  [PAD.03X.04]  42,36 0 bottom
TP160  TEST-POINT3X4  [PAD.03X.04]  62.5,42 270 top
TP161  TEST-POINT3X4  [PAD.03X.04]  64,42 90 top
TP163  TEST-POINT3X4  [PAD.03X.04]  60,40.5 0 bottom
TP164  TEST-POINT3X4  [PAD.03X.04]  66,50 180 top
TP165  TEST-POINT3X4  [PAD.03X.04]  68,50 180 top
TP166  TEST-POINT3X4  [PAD.03X.04]  65.5,42 270 top
TP167  TEST-POINT3X4  [PAD.03X.04]  29.5,49.5 180 bottom
TP168  TEST-POINT3X4  [PAD.03X.04]  25,53 0 bottom
TP173  TEST-POINT3X4  [PAD.03X.04]  31,49.5 0 bottom
TP183  TEST-POINT3X4  [PAD.03X.04]  39.5,84.5 0 top
TP184  TEST-POINT3X4  [PAD.03X.04]  41,84.5 0 top
U1  RCLAMP0504FB  [SC70-6]  57.25,16.5 90 top
U2  DS90CR218AMTD/NOPBMTD48_TEX-L  [MTD48_TEX-L]  25.75,74 90 top
U3  THGBMJG7C2LBAU8  [BGA-153(11.5X13)(EMMC-BA)]  19.9,20 270 top
U4  SN74LVC1G07DCK  [C70(TI-DCK)]  64,24 0 top
U7  OSD3358-512M-BSM  [OSD335X-BGA-256]  51,39 270 top
U10  TLVH431  [SOT23-3]  65,57.5 0 top
U11  TCAN330  [SOT23-8_TI-DCN]  82,57 0 top
U12  MIC842LYC5  [SC70-5]  40.5,63.9 180 top
U13  MIC842LYC5  [SC70-5]  40.5,67.9 180 top
U14  MAX4211FETE  [QFN65P400X400X80-17T210]  67,68.9 0 top
U15  TPS62112  [S-PVQFN-16]  80.46,69.12 270 top
U16  MAX7310ATE  [QFN65P400X400X80-17T210]  47.5,76.4 0 top
U17  25AAXX  [SOIC8]  74,46.5 0 top
U$1  FLIGHMARKERNEW  [FLIGHTMARKER_NEW_BOARDS]  7.1,59.7 90 top
U$2  [CAMERA_BOARD_TOP_DIMS]  10.25,21.1 0 top
U$3  [PSAS_LOGO_10X10]  88,29.9 0 top
U$4  [ORESAT_ORIENTATION_COPPER]  88,43.5 0 top
Y1  24MHz  [5X3.2-4SMD]  67.41,32.66 90 top
Y2  ABS07-32.768KHZ-T  [CRYSTAL_3.2X1.5]  47.19,54.81 0 top